# EAGLE schematic H-Bridge (EAGLE 7.7.0)
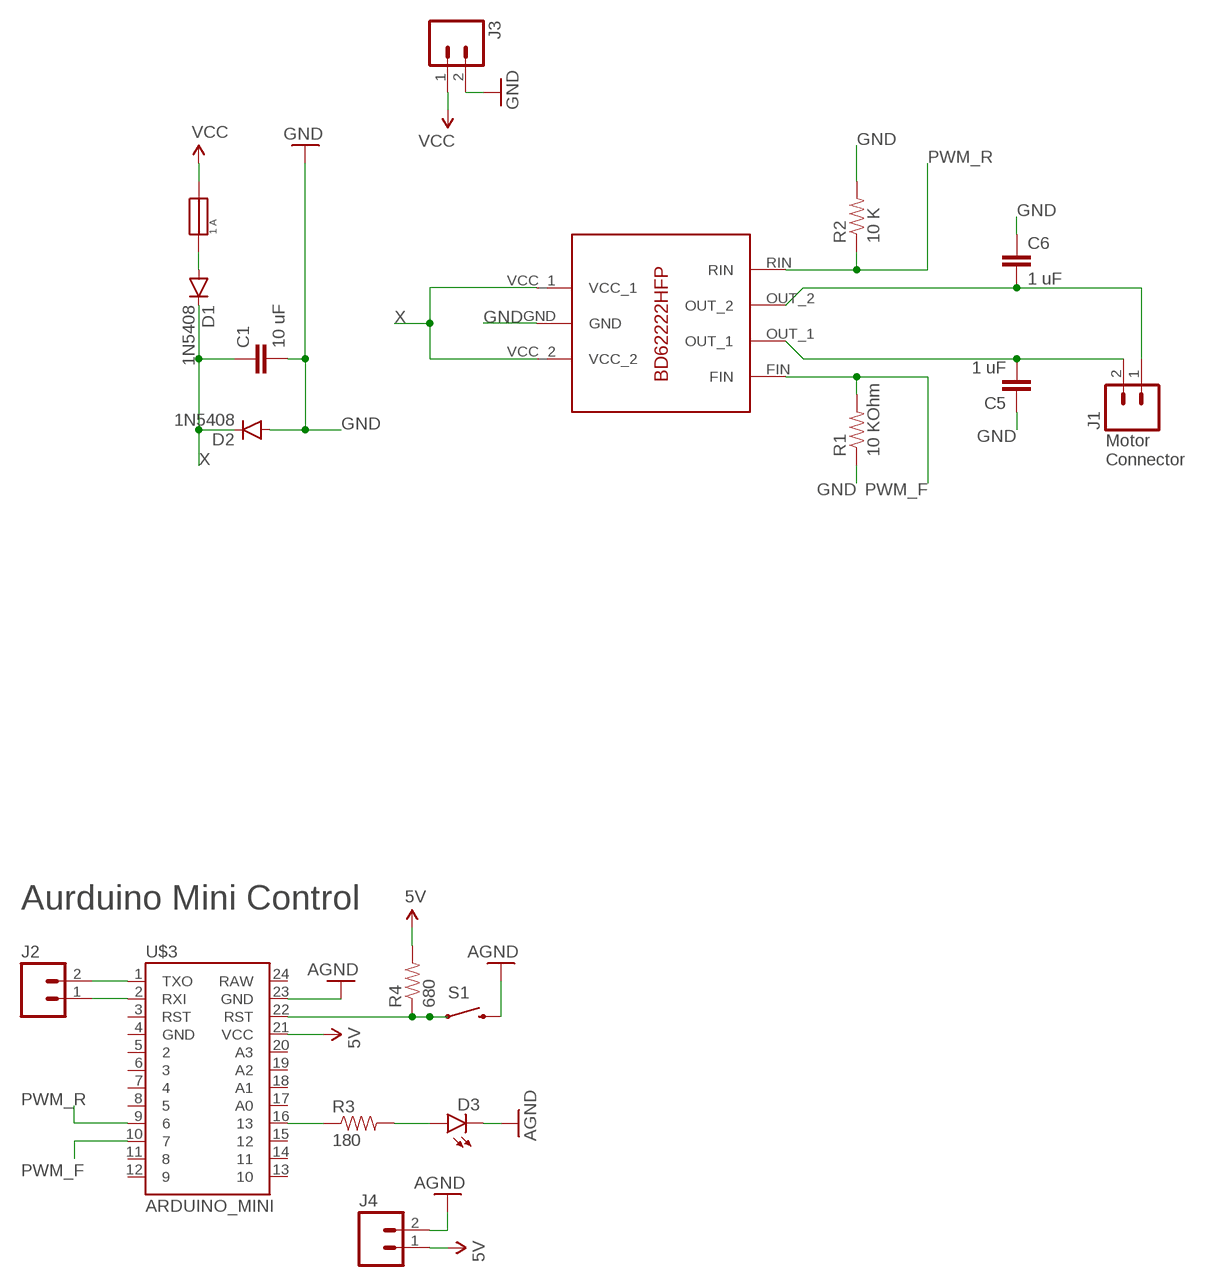
[diagram p0: schematic, sheet 1]

## Parts
C1  10 uF  CAP0805  [0805]
C5  1 uF  CAP0805  [0805]
C6  1 uF  CAP0805  [0805]
D1  1N5408  DIODE1N4148  [DIODE-1N4148]
D2  1N5408  DIODE1N4148  [DIODE-1N4148]
D3  LED3MM  [LED3MM]
J1  M023.5MM  [SCREWTERMINAL-3.5MM-2]
J2  M02LOCK  [1X02_LOCK]
J3  M023.5MM  [SCREWTERMINAL-3.5MM-2]
J4  M023.5MM  [SCREWTERMINAL-3.5MM-2]
R1  10 KOhm  RESISTORPTH-1/6W  [1/6W-RES]
R2  10 K  RESISTORPTH-1/6W  [1/6W-RES]
R3  180  RESISTORAXIAL-0.3  [AXIAL-0.3]
R4  680  RESISTORAXIAL-0.3  [AXIAL-0.3]
S1  SWITCH-MOMENTARY-2PTH  [TACTILE-PTH]
U$1  BD62222HFP  [BD62222HFP]
U$3  ARDUINO_MINI  [ARDUINO_MINI]
U$8  1 A  5MM_PC_FUSE_HOLDER_KEYSTONE_ELEC  [5MM_PC_FUSE_HOLDER_KEYSTONE_ELEC]

## Nets
5V: J4.1 R4.P$2 U$3.21(VCC)
AGND: D3.K(C) J4.2 S1.3 U$3.23(GND)
GND: C1.2 C5.1 C6.1 D2.A J3.2 R1.1 R2.2 U$1.GND
N$1: C5.2 J1.2 U$1.OUT_1
N$2: C6.2 J1.1 U$1.OUT_2
N$3: R3.P$1 U$3.16
N$4: D3.A R3.P$2
N$5: R4.P$1 S1.1 U$3.22(RST)
N$6: J2.1 U$3.2(RXI)
N$7: J2.2 U$3.1(TXO)
N$10: D1.A U$8.P$2
PWM_F: R1.2 U$1.FIN U$3.10
PWM_R: R2.1 U$1.RIN U$3.9
VCC: J3.1 U$8.P$1
X: C1.1 D1.C D2.C U$1.VCC_1 U$1.VCC_2
Unconnected: U$3.3(RST) U$3.4(GND) U$3.5 U$3.6 U$3.7 U$3.8 U$3.11 U$3.12 U$3.13 U$3.14 U$3.15 U$3.17(A0) U$3.18(A1) U$3.19(A2) U$3.20(A3) U$3.24(RAW)

## Notes on the sheet
- Motor
  Connector
- Aurduino Mini Control

## Library data of the parts
C1 = SparkFun-Passives:CAP: Capacitor Standard 0603 ceramic capacitor, and 0.1" leaded capacitor.; CAPACITANCE: 10 uF
C5 C6 = SparkFun-Passives:CAP: Capacitor Standard 0603 ceramic capacitor, and 0.1" leaded capacitor.
D1 D2 = SparkFun-DiscreteSemi:DIODE: Diode These are standard reverse protection diodes and small signal diodes. SMA package can handle up to about 1A. SOD-323 can handle about 200mA. What the SOD-323 package when ordering, there are some mfgs out there that are 5-pin packages.; PROD_ID: DIO-08378; VALUE: 1N4148
D3 = SparkFun-LED:LED: LEDs Standard schematic elements and footprints for 5mm, 3mm, 1206, and 0603 sized LEDs. 5mm - Spark Fun Electronics SKU : COM-00529 (and others); PROD_ID: DIO-08794
J1 J3 J4 = SparkFun-Connectors:M02: Standard 2-pin 0.1" header. Use with - straight break away headers ( PRT-00116) - right angle break away headers (PRT-00553) - swiss pins (PRT-00743) - machine pins (PRT-00117) - female headers (PRT-00115) Molex polarized connector foot print use with: PRT-08233 with associated crimp pins and housings. 2.54_SCREWTERM for use with PRT-10571. 3.5mm Screw Terminal footprints for PRT-08084 5mm Screw Terminal footprints for use with PRT-08432; PROD_ID: CONN-08399
J2 = SparkFun-Connectors:M02: Standard 2-pin 0.1" header. Use with - straight break away headers ( PRT-00116) - right angle break away headers (PRT-00553) - swiss pins (PRT-00743) - machine pins (PRT-00117) - female headers (PRT-00115) Molex polarized connector foot print use with: PRT-08233 with associated crimp pins and housings. 2.54_SCREWTERM for use with PRT-10571. 3.5mm Screw Terminal footprints for PRT-08084 5mm Screw Terminal footprints for use with PRT-08432
R1-R4 = SparkFun-Passives:RESISTOR: Resistor Basic schematic elements and footprints for 0603, 1206, and PTH resistors.
S1 = SparkFun-Electromechanical:SWITCH-MOMENTARY-2: Various NO switches- pushbuttons, reed, etc; PROD_ID: SWCH-08441
U$1 = BD62222HFP:BD62222HFP
U$3 = SparkFun-Boards:ARDUINO_MINI: Arduino Pro Mini footprint
U$8 = 5mm PC Fuse Holder Keystone Elec:5MM_PC_FUSE_HOLDER_KEYSTONE_ELEC